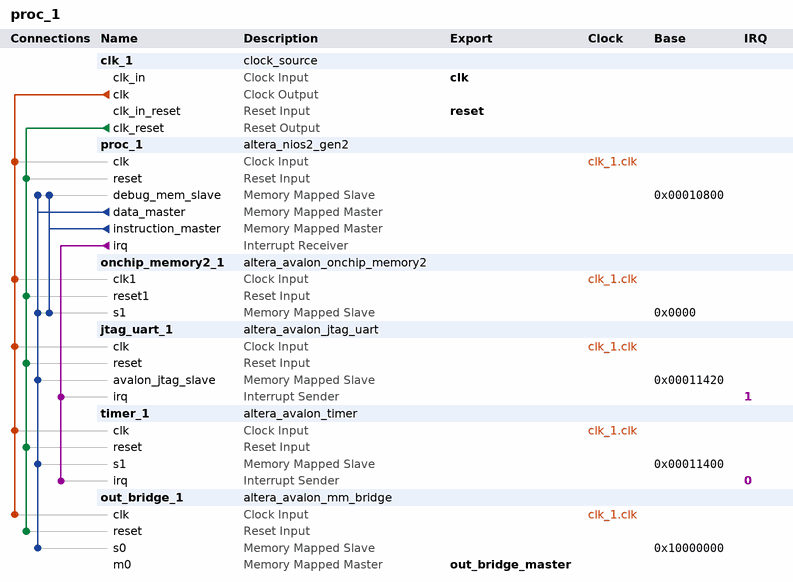
[diagram p0: system contents]
# Platform Designer (Qsys) system proc_1, Cyclone V 5CSEMA5F31C6
# Parameters at their usual value, and those the tool derives, are not listed.
package require -exact qsys 16.1
create_system proc_1
set_project_property DEVICE_FAMILY {Cyclone V}
set_project_property DEVICE 5CSEMA5F31C6

add_instance clk_1 clock_source 16.1
set_instance_parameter_value clk_1 clockFrequency 50000000

add_instance proc_1 altera_nios2_gen2 16.1
set_instance_parameter_value proc_1 dcache_size 2048
set_instance_parameter_value proc_1 exceptionSlave onchip_memory2_1.s1
set_instance_parameter_value proc_1 icache_size 4096
set_instance_parameter_value proc_1 impl Fast
set_instance_parameter_value proc_1 resetSlave onchip_memory2_1.s1

add_instance onchip_memory2_1 altera_avalon_onchip_memory2 16.1
set_instance_parameter_value onchip_memory2_1 dataWidth 32
set_instance_parameter_value onchip_memory2_1 dualPort false
set_instance_parameter_value onchip_memory2_1 initMemContent true
set_instance_parameter_value onchip_memory2_1 initializationFileName onchip_mem.hex
set_instance_parameter_value onchip_memory2_1 memorySize 40000

add_instance jtag_uart_1 altera_avalon_jtag_uart 16.1
set_instance_parameter_value jtag_uart_1 simInteractiveOptions NO_INTERACTIVE_WINDOWS

add_instance timer_1 altera_avalon_timer 16.1
set_instance_parameter_value timer_1 period 1
set_instance_parameter_value timer_1 periodUnits MSEC

add_instance out_bridge_1 altera_avalon_mm_bridge 16.1
set_instance_parameter_value out_bridge_1 ADDRESS_UNITS SYMBOLS
set_instance_parameter_value out_bridge_1 ADDRESS_WIDTH 10
set_instance_parameter_value out_bridge_1 DATA_WIDTH 32
set_instance_parameter_value out_bridge_1 MAX_PENDING_RESPONSES 4
set_instance_parameter_value out_bridge_1 USE_AUTO_ADDRESS_WIDTH 1

# connections
add_connection clk_1.clk jtag_uart_1.clk clock
add_connection clk_1.clk onchip_memory2_1.clk1 clock
add_connection clk_1.clk out_bridge_1.clk clock
add_connection clk_1.clk proc_1.clk clock
add_connection clk_1.clk timer_1.clk clock
add_connection clk_1.clk_reset jtag_uart_1.reset reset
add_connection clk_1.clk_reset onchip_memory2_1.reset1 reset
add_connection clk_1.clk_reset out_bridge_1.reset reset
add_connection clk_1.clk_reset proc_1.reset reset
add_connection clk_1.clk_reset timer_1.reset reset
add_connection proc_1.data_master jtag_uart_1.avalon_jtag_slave avalon
set_connection_parameter_value proc_1.data_master/jtag_uart_1.avalon_jtag_slave baseAddress 0x00011420
add_connection proc_1.data_master onchip_memory2_1.s1 avalon
set_connection_parameter_value proc_1.data_master/onchip_memory2_1.s1 baseAddress 0x0000
add_connection proc_1.data_master out_bridge_1.s0 avalon
set_connection_parameter_value proc_1.data_master/out_bridge_1.s0 baseAddress 0x10000000
add_connection proc_1.data_master proc_1.debug_mem_slave avalon
set_connection_parameter_value proc_1.data_master/proc_1.debug_mem_slave baseAddress 0x00010800
add_connection proc_1.data_master timer_1.s1 avalon
set_connection_parameter_value proc_1.data_master/timer_1.s1 baseAddress 0x00011400
add_connection proc_1.instruction_master onchip_memory2_1.s1 avalon
set_connection_parameter_value proc_1.instruction_master/onchip_memory2_1.s1 baseAddress 0x0000
add_connection proc_1.instruction_master proc_1.debug_mem_slave avalon
set_connection_parameter_value proc_1.instruction_master/proc_1.debug_mem_slave baseAddress 0x00010800
add_connection proc_1.irq jtag_uart_1.irq interrupt
set_connection_parameter_value proc_1.irq/jtag_uart_1.irq irqNumber 1
add_connection proc_1.irq timer_1.irq interrupt
set_connection_parameter_value proc_1.irq/timer_1.irq irqNumber 0

# exported interfaces
add_interface clk clock sink
set_interface_property clk EXPORT_OF clk_1.clk_in
add_interface out_bridge_master avalon master
set_interface_property out_bridge_master EXPORT_OF out_bridge_1.m0
add_interface reset reset sink
set_interface_property reset EXPORT_OF clk_1.clk_in_reset

set_interconnect_requirement {$system} qsys_mm.clockCrossingAdapter HANDSHAKE
set_interconnect_requirement {$system} qsys_mm.enableEccProtection FALSE
set_interconnect_requirement {$system} qsys_mm.insertDefaultSlave FALSE
set_interconnect_requirement {$system} qsys_mm.maxAdditionalLatency 1

save_system proc_1.qsys
